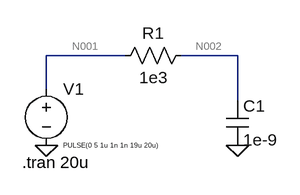
[diagram p0: schematic Draft2.asc]
Draft2.asc, the LTspice schematic file:
Version 4
SHEET 1 880 680
WIRE 16 160 -96 160
WIRE 176 160 96 160
WIRE -96 208 -96 160
WIRE 176 224 176 160
FLAG -96 288 0
FLAG 176 288 0
SYMBOL res 112 144 R90
WINDOW 0 0 56 VBottom 2
WINDOW 3 32 56 VTop 2
SYMATTR InstName R1
SYMATTR Value 1e3
SYMBOL cap 160 224 R0
SYMATTR InstName C1
SYMATTR Value 1e-9
SYMBOL voltage -96 192 R0
WINDOW 3 24 96 Left 0
WINDOW 123 0 0 Left 0
WINDOW 39 0 0 Left 0
SYMATTR InstName V1
SYMATTR Value PULSE(0 5 1u 1n 1n 19u 20u)
TEXT -130 312 Left 2 !.tran 20u

The netlist it stands for:
* Draft2.asc
R1 N002 N001 1e3
C1 N002 0 1e-9
V1 N001 0 PULSE(0 5 1u 1n 1n 19u 20u)
.tran 20u
.backanno
.end

* Results of the author's LTspice run, read from the files saved beside the schematic
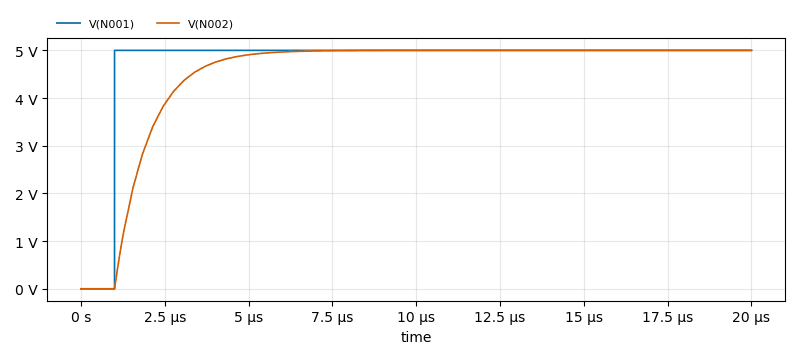
[diagram p1: Transient Analysis of Draft2.asc, plotted from the saved traces]
* Transient Analysis, 1 run:
*   V(N001): min 0 V, max 5 V, average 4.75 V, rms 4.873 V, last 5 V
*   V(N002): min 0 V, max 5 V, average 4.498 V, rms 4.677 V, last 5 V